# EAGLE design StripConnectorUSB64 (EAGLE 8.2.1)
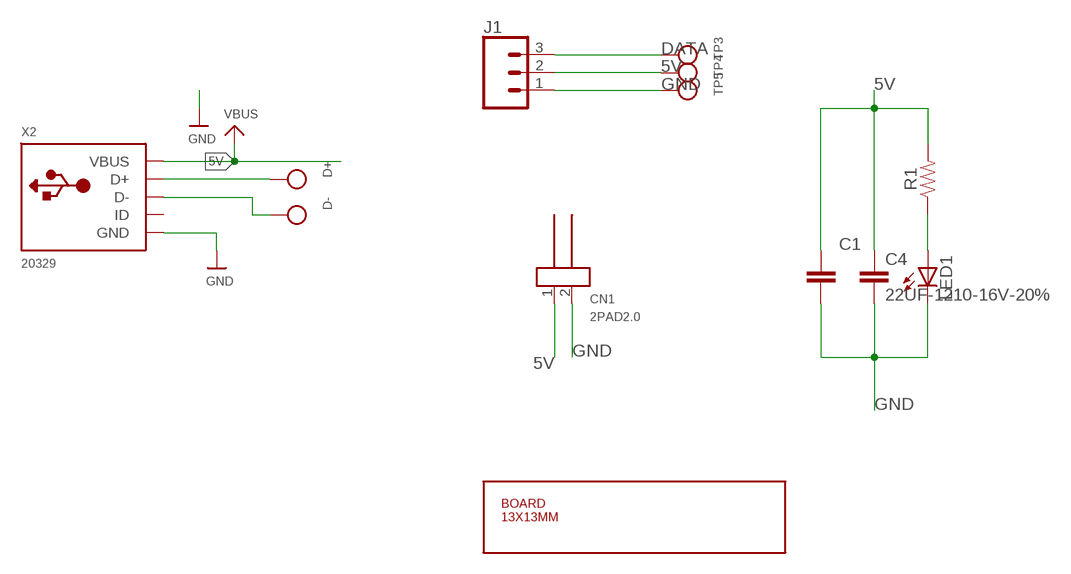
[diagram p0: schematic, sheet 1]

## Parts
C1  CAPACITOR_NPOL-0805  [C805]
C4  22UF-1210-16V-20%  [1210]
CN1  2PAD2.0  [2POLE_P2.0]
D+  TESTPOINTROUND1MM  [TESTPOINT_ROUND_1MM]
D-  TESTPOINTROUND1MM  [TESTPOINT_ROUND_1MM]
J1  CONN_03LONGPADS  [1X03_LONGPADS]
LED1  LED-0805  [LED-805]
R1  RESISTOR0805  [0805]
TP3  TESTPOINTROUND1MM  [TESTPOINT_ROUND_1MM]
TP4  TESTPOINTROUND1MM  [TESTPOINT_ROUND_1MM]
TP5  TESTPOINTROUND1MM  [TESTPOINT_ROUND_1MM]
U$1  BOARD_13X13MM  [13X13]
X2  20329  USB_MICRO_20329_V2  [4UCONN_20329_V2]

## Nets
5V: C1.1 C4.1 CN1.1 J1.2 R1.2 TP4.P$1 X2.VBUS ; supply symbol labelled VBUS
DATA: J1.3 TP3.P$1
GND: C1.2 C4.2 CN1.2 J1.1 LED1.C TP5.P$1 X2.BASE@1(GND) X2.BASE@2(GND) X2.GND X2.SPRT@1(GND) X2.SPRT@2(GND) X2.SPRT@3(GND) X2.SPRT@4(GND)
N$1: D-.P$1 X2.D-
N$2: LED1.A R1.1
N$3: D+.P$1 X2.D+
Unconnected: X2.ID

## Library data of the parts
C1 = dp_devices:CAPACITOR_NPOL: Non-Polarized capacitor in various packages
C4 = SparkFun-Capacitors:22UF: 22µF ceramic capacitors A capacitor is a passive two-terminal electrical component used to store electrical energy temporarily in an electric field.
CN1 = Pad:2PAD
D+ D- TP3-TP5 = microbuilder:TESTPOINT: Test Point Various test points for characterisation and PCB testing TESTPOINT_SMT - Compact Surface Mount Test Point [Digikey: 5016KTR-ND]
J1 = SparkFun-Connectors:CONN_03: Multi connection point. Often used as Generic Header-pin footprint for 0.1 inch spaced/style header connections On any of the 0.1 inch spaced packages, you can populate with these: Break Away Headers - Straight <https://www.sparkfun.com/products/116> (PRT-00116) Break Away Male Headers - Right Angle <https://www.sparkfun.com/products/553> (PRT-00553) Female Headers <https://www.sparkfun.com/products/115> (PRT-00115) Break Away Headers - Machine Pin <https://www.sparkfun.com/products/117> (PRT-00117) Break Away Female Headers - Swiss Machine Pin <https://www.sparkfun.com/products/743> (PRT-00743) Stackable Header - 3 Pin (Female, 0.1") <https://www.sparkfun.com/products/13875> (PRT-13875) For SCREWTERMINALS and SPRING TERMINALS visit here: Screw Terimnals on SparkFun.com <https://www.sparkfun.com/search/results?term=Screw+Terminals> (5mm/3.5mm/2.54mm spacing) This device is also useful as a general connection point to wire up your design to another part of your project. Our various solder wires solder well into these plated through hole pads. Hook-Up Wire - Assortment (Stranded, 22 AWG) <https://www.sparkfun.com/products/11375> (PRT-11375) Hook-Up Wire - Assortment (Solid Core, 22 AWG) <https://www.sparkfun.com/products/11367> (PRT-11367) View the entire wire category on our website here <https://www.sparkfun.com/categories/141> Special notes: Molex polarized connector foot print use with SKU : PRT-08232 with associated crimp pins and housings.
LED1 = dp_devices:LED: Light Emitting Diode
R1 = SparkFun-Resistors:RESISTOR: Generic Resistor Package
U$1 = MyBreadBoards:BOARD_13X13MM
X2 = microbuilder:USB: USB Connectors USBMINIB - Surface Mount Female Mini-B USB Connector 4UConnector: 06564

## Board
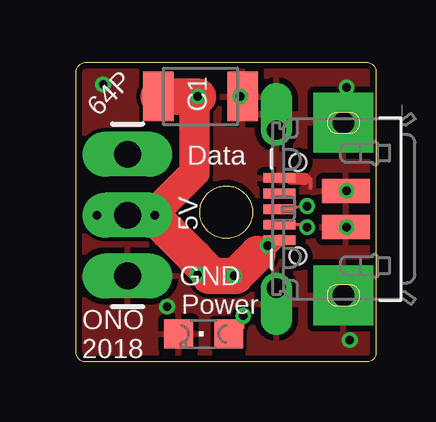
[diagram p1: board, top side]
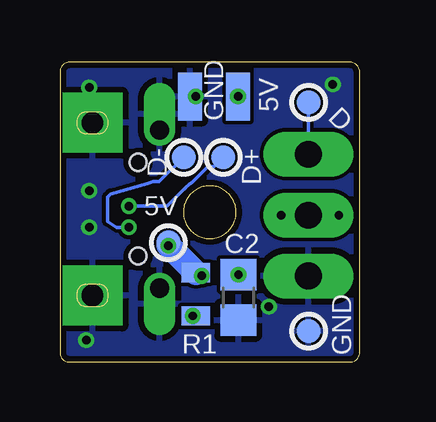
[diagram p2: board, bottom side, seen from below]

Size 12.5 x 12.5 mm. Coordinates in mm from the lower left corner, seen from the top.
Copper layers (1*16): Top 0.035mm / dielectric 1.5mm / Bottom 0.035mm
Design rules "dirt_cheap_dirty_boards.v2": minimum track width 5mil, minimum drill 12mil, track to track 6mil, track to pad 6mil, pad to pad 6mil, via to via 6mil, smd to smd 0mil, copper to edge 10mil, drill to drill 10mil, minimum pad ring 10mil, minimum via ring 6mil, stop-mask expansion 2mil, vias tented up to drill 25mil, thermal gap 10mil

### Footprints (pad centres in the part's own frame; a part is rotated, then mirrored left to right if it is on the bottom)
C805 = smd 1.3 x 1.5: 1 -0.95,0; 2 0.95,0
1210 = smd 1.27 x 2.06: 1 -1.755,0; 2 1.755,0
2POLE_P2.0 = smd 1 x 2: 1 1,0; 2 -1,0
TESTPOINT_ROUND_1MM = smd 1 x 1: P$1 0,0
1X03_LONGPADS = drill 1.118 pad 1.88 long: 1 0,0; 2 2.54,0; 3 5.08,0
LED-805 = smd 1.2 x 1.2: A 0,-1.05; C 0,1.05
0805 = smd 0.8 x 1.2: 1 -0.9,0; 2 0.9,0
4UCONN_20329_V2 = smd 1 x 2: BASE@1 -0.75,-2; BASE@2 0.75,-2 | smd 0.4 x 1.35: D+ 0,0.775; D- -0.65,0.775; GND 1.3,0.775; ID 0.65,0.775; VBUS -1.3,0.775 | drill 0.8 pad 1.2 offset: SPRT@1 -3.3,0.9; SPRT@2 3.3,0.9 | drill 0.9 pad 2.5 square: SPRT@3 -3.6,-1.9; SPRT@4 3.6,-1.9 | hole 0.7: -1.95,0; 1.95,0

### Placement (x,y rotation side)
C1  5.05,2.7 270 bottom
C4  5.18,11.08 0 top
CN1  6.07,11.08 0 bottom
D+  5.69,8.54 0 bottom
D-  7.34,8.54 90 bottom
J1  2.13,3.58 90 top
LED1  5.31,1.17 90 top
R1  6.83,2.82 90 bottom
TP3  2.13,10.82 0 bottom
TP4  7.98,4.98 90 bottom
TP5  2.13,1.3 90 bottom
U$1  -0.03,-0.1 0 top
X2  9.25,6.38 90 top

### Tracks (layer width: path | path; a pad name or v marks a point on that pad's centre or on a via)
5V  (via drill 0.35)
  Top 0.152: 6.32,3.58 6.82,3.58 v6.58,3.6 | C1.1 5.12,3.65 5.56,3.58 | C4.1 4.93,11.08 CN1.1
  Top 0.508: 7.56,4.51 7.9,4.51 X2.VBUS
  Top 1.27: 3.15,6.12 4.93,7.9 4.93,11.08
  Top 1.524: 6.32,3.58 5.56,3.58 5.56,3.71 4.93,4.35 3.84,5.44 3.15,6.12 J1.2 | v6.58,3.6 6.64,3.6 7.56,4.51 | CN1.1 C4.1
  Bottom 0.152: R1.2 6.71,3.72 v6.58,3.6 | TP4.P$1 v7.98,4.85
  Bottom 1.016: R1.2 7.98,4.87 TP4.P$1 | v0.86,6.12 J1.2 2.39,6.12 2.51,6.25 3.15,6.25 v3.28,6.12
  other vias: 5.05,3.65 5.07,11.08
DATA
  Bottom 0.152: J1.3 TP3.P$1
GND  (via drill 0.35)
  Top 0.152: X2.GND 8.93,7.68 8.96,7.65 | 9.53,7.65 | 9.53,7.65 9.75,7.65 9.75,7.27
  Top 0.508: 8.96,7.65 9.53,7.65
  Bottom 0.152: CN1.2 v6.83,11.08
  other vias: 1.12,11.59 11.28,11.46 3.78,2.31 11.4,0.92 11.28,5.62 11.28,7.14
  pour Top: -1.3,12.6 -1.3,-0.1 -0.03,-1.37 12.67,-1.37 13.94,-0.1 13.94,12.6 12.67,13.87 -0.03,13.87
  pour Bottom: -1.3,12.6 -1.3,-0.1 -0.03,-1.37 12.67,-1.37 13.94,-0.1 13.94,12.6 12.67,13.87 -0.03,13.87
N$1  (via drill 0.35)
  Top 0.152: X2.D- 9.61,5.73 v9.63,5.62
  Bottom 0.152: v9.63,5.62 10.13,5.62 10.52,5.87 10.52,6.89 10.39,7.01 8.85,7.45 8.61,7.52 8.36,7.52 D-.P$1
N$2  (via drill 0.35)
  Top 0.152: LED1.A 6.95,1.43 v6.96,1.92
  Bottom 0.152: R1.1 v6.96,1.92
N$3  (via drill 0.35)
  Top 0.152: v9.63,6.51 X2.D+
  Bottom 0.152: v9.63,6.51 8.04,6.51 7.32,7.22 7.3,7.22 7.3,7.23 7.29,7.24 7.27,7.27 7.25,7.29 7.22,7.31 7.22,7.32 7.16,7.36 7.12,7.41 7.11,7.41 7.08,7.43 7.06,7.44 7.03,7.46 7.02,7.46 7,7.49 6.99,7.49 6.32,8.16 6.07,8.16 D+.P$1

### Text on the board
tPlace: C1 | 64P | Data | 5V | GND | Power | ONO / 2018
bPlace: 5V | D | GND | 5V | C2 | R1 | GND